# Altium project Turbidity V2.PrjPcb
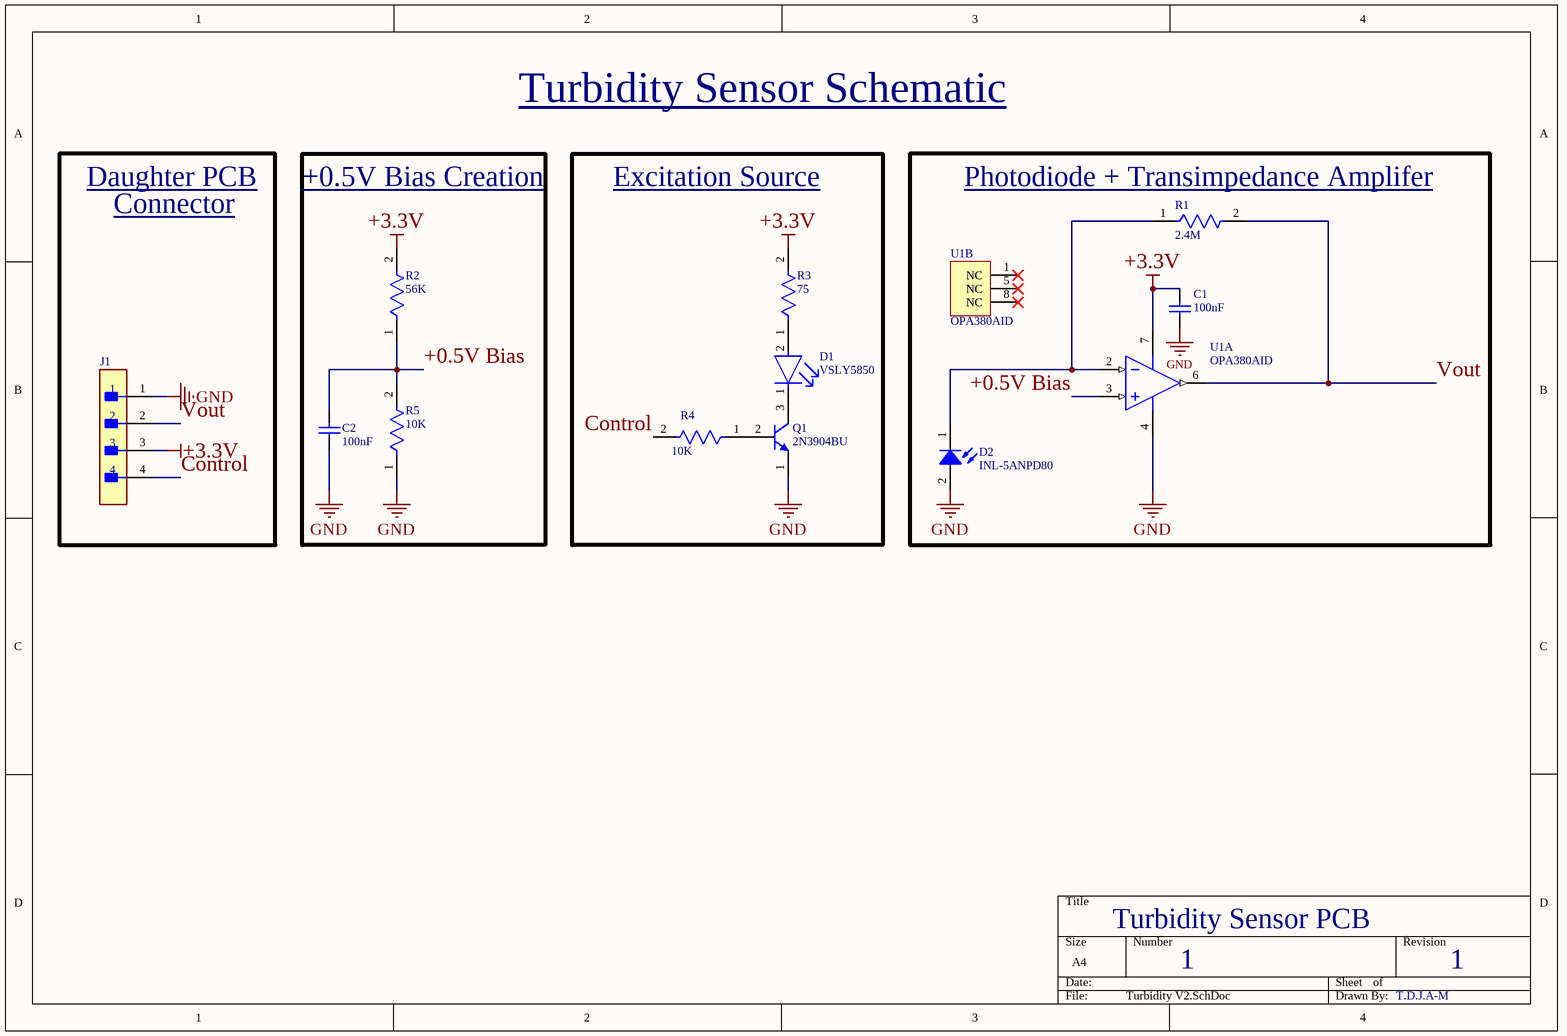
[diagram p0: Turbidity V2.SchDoc]
1 sheet, 12 parts. Net scope: global (net labels, ports and power ports of the same name join across sheets).
Board file: Turbidity V2.PcbDoc

## Sheet Turbidity V2.SchDoc
size A4; SheetNumber: 1; SheetTotal: 1

### Parts
C1  100nF  [CAPC2013X145X48ML20T23]
C2  100nF  [CAPC2013X145X48ML20T23]
D1  VSLY5850  [FP-XLUR12D-MFG]
D2  INL-5ANPD80  [WL-TDRW_D5.8H8.7]
J1  (no value)  [FP-22-29-2041-MFG]
Q1  2N3904BU  [FAIR-TO-92]
R1  2.4M  [FP-RT0805-IPC_A]
R2  56K  [FP-RT0805-IPC_A]
R3  75  [FP-RT0805-IPC_A]
R4  10K  [FP-RT0805-IPC_A]
R5  10K  [FP-RT0805-IPC_A]
U1  OPA380AID  [D0008A_L]  (parts A,B of 2)

### Blocks framed on the sheet
+0.5V Bias Creation: C2 R2 R5
Excitation Source: D1 Q1 R3 R4
Photodiode + Transimpedance Amplifer: C1 D2 R1 U1

### Nets
+3.3V: C1.2 J1.3 R2.2 R3.2 U1.7(V+)
GND: C1.1 C2.1 D2.2(A) J1.1 Q1.1(E) R5.1 U1.4(V-)
+0.5V Bias: C2.2 R2.1 R5.2 U1.3(IN+)
Control: J1.4 R4.2
Vout: J1.2 R1.2 U1.6(OUT)
NetD1_1: D1.1(C) Q1.3(C)
NetD1_2: D1.2(A) R3.1
NetD2_1: D2.1(K) R1.1 U1.2(IN-)
NetQ1_2: Q1.2(B) R4.1

Not connected (* = marked no-connect by the designer): U1 1(NC)* 5(NC)* 8(NC)*

### Notes on the sheet
- Turbidity Sensor Schematic
- Daughter PCB
- Connector
- Turbidity Sensor PCB
- 1
- T.D.J.A-M

### Library data of the parts
C1 C2 = CMP-2007-03205-1: Manufacturer: Vitramon; Part Number: VJ0805Y682KXAMT
D1 = CMP-02085-08376351-1: 627nm Red LED; 5x8.6mm, Through-Hole Mount with Red Diffused Round Lamp; Test Current: 10mA; Viewing Angle: 30°; Dominant Wavelength: 617nm; Luminous Intensity: 39mcd; Forward Voltage: 1.9V; Wavelength: 627nm; Case/Package: Radial; Lens Color: Red; Mount: Through Hole; Height: 8.6mm; Color: Red; Lifecycle Status: Production; Lens Transparency: Diffused; RoHS: Compliant
D2 = CMP-03913-98687784-1: 1540051EA3590 WL-TDRW THT Photodiode Round Waterclear; Viewing Angle: 35°; Max Reverse Voltage (DC): 30V; NexarPartId: 98687784; Height: 8.7mm; RoHS: Compliant; Width: 5mm; Min Operating Temperature: -40°C; Length: 5.8mm; Max Operating Temperature: 85°C
J1 = CMP-04776-000366-1: CONN HEADER VERT 4POS 2.54MM; Insulation Resistance: 50GR; Voltage Rating: 250V; Glow Wire Compliant: Non-compliant; Max Current Rating: 4A; Number of Circuits: 4; Contact Resistance: 10mR; Gender: Male; Number of Lines: 1; Length: 10.16mm; Radiation Hardening: No; Pitch: 2.54mm; Contact Material: Brass; Height: 11.7mm; Max Operating Temperature: 75°C; Flammability Rating: UL94 V-0; Mount: Through Hole; Voltage Rating (DC): 250V; Halogen Free: Low Halogen; Housing Color: White; Package Quantity: 1500; Series: KK® 6410; Number of Rows: 1; Housing Material: Nylon; Depth: 5.8mm; RoHS Compliant: Yes; Orientation: Straight; Contact Gender: Male; Color: Natural; Current Rating: 4A; Contact Mating Length: 0.295inch; Number of Poles: 4; Packaging: Bulk; Contact Type: Male Pin; Termination: Solder; Number of Positions: 4; Number of Contacts: 4; Lead Free: Lead Free; Min Operating Temperature: 0°C; Fastening Type: Friction; Contact Plating: Gold
Q1 = CMP-2000-04944-1: NPN General-Purpose Amplifier, 40 V VCEO, 0.2 A, -55 to 150 degC, 2-Pin TO-92, RoHS, Bulk; Manufacturer: FairchildSemiconductor; Maximum Collector Base Voltage: 60V; Minimum DC Current Gain: 40@0.1mA@1V; Maximum Collector Emitter Voltage: 40V; Maximum DC Collector Current: 0.2A; Rad Hard: No; Maximum Operating Frequency: 300(Min)MHz; Maximum Collector Emitter Saturation Voltage: 0.2@1mA@10mA; Maximum Power Dissipation: 625mW; Package Description: 3-Pin Transistor Outline Package, Body Dia 4.79 mm, Pitch 1.27 mm; Package Reference: TO-92; Pin Count: 3; Operating Temperature: -55to150degC; Category: GPBJT; Manufacturer URL: https://www.fairchildsemi.com/; Datasheet URL: https://datasheet.ciiva.com/4722/2n3904-82270-4722369.pdf; Package: 3TO-92; Packaging: Bulk; Type: NPN; Datasheet Version: Rev. 1.1.0, 10/2014; Mounting: ThroughHole
R1-R5 = CMP-03412-002763-1: RES SMD 681 OHM 0.1% 1/8W 0805; Manufacturer: Yageo; Manufacturer Part Number: RT0805BRD07681RL; Value: 681Ω; Temperature Coefficient: 25 ppm/°C; Power Rating: 0.125W; Voltage Rating: 150V; Tolerance: 0.0025; ComponentLink2URL: http://www.yageo.com/documents/recent/PYu-RT_1-to-0.01_RoHS_L_9.pdf; Ipc Land Pattern Name: RESC200125X50; Footprint Url: http://www.yageo.com/exep/pages/download/literatures/PYu-R_Mount_10.pdf; Temperature: -55°C to +155°C; Resistance: 681Ω; Mouser Description: Thin Film Resistors - SMD 1/8W 681 ohm .1% 25ppm; Temperature Range High: +155°C; Device Class L3: Chip SMD Resistors; Automotive: No; Octopart: https://octopart.com/rt0805brd07681rl-yageo-1270194; Device Class L1: Passive Components; Package: RT0805; Device Class L2: Resistors; Category: Res; RoHS: TRUE; Composition: Thin Film; ComponentLink2Description: Datasheet; Temperature Range Low: -55°C; Lead Free: Yes; Digikey Description: RES SMD 681 OHM 0.1% 1/8W 0805; Height: 0.6mm; Series: RT
U1 = CMP-0018-00235-2: High Speed Precision Transimpedance Amplifier, 2.7 to 5.5 V, -40 to 125 degC, 8-pin SOIC (D8), Green (RoHS & no Sb/Br); Manufacturer: Texas Instruments; Iq per channel(Max)(mA): 8.8; Vn at Flatband(Typ)(nV/rtHz): 3; Number of Channels: 1; Vio(Max)(mV): 0.025; Iib(Max)(nA): 0.05; Vs(Max)(V): 5.5; Slew Rate(Typ)(V/us): 80; Vs(Min)(V): 2.7; Sub Family: High Speed Amplifier (>=50MHz), Low Offset Voltage Amplifier (<=500uV), Low Supply Voltage Amplifier (<=2.7V); PackageVersion: 4040047-3/M, 06/2011; Eco-Plan: Green (RoHS & no Sb/Br); PackageDescription: 8-Pin Plastic Small Outline, Body 4.9 x 3.9 mm, Pitch 1.27 mm; ComponentLink3Description: Package Specification; Mounting Technology: Surface Mount; Code_JEDEC: MS-012; ComponentLink2URL: http://www.ti.com/general/docs/lit/getliterature.tsp?genericPartNumber=OPA380&fileType=pdf; PackageReference: D0008A; ComponentLink1Description: Manufacturer URL; ComponentLink2Description: Datasheet; PartNumber: OPA380AID; DatasheetVersion: SBOS291G; ComponentLink3URL: http://www.ti.com/litv/pdf/msoi002j; ComponentLink1URL: http://www.ti.com/